# Altium schematic sheet UpperBoardAnalogInputs.SchDoc
size A4; PageSetup: Record=PageOptions|CenterHorizontal=True|CenterVertical=True|PrintScale=1.00|XCorrection=1.00|YCorrection=1.00|PrintKind=0|BorderSize=5000000|LeftOffset=0|BottomOffset=0|Orientation=2|PaperLength=1000|PaperWidth=1000|Scale=100|PaperSource=7|PrintQuality=-3|MediaType=1|DitherType=10|PrintScaleMode=1|PaperKind=A4|PaperIndex=9
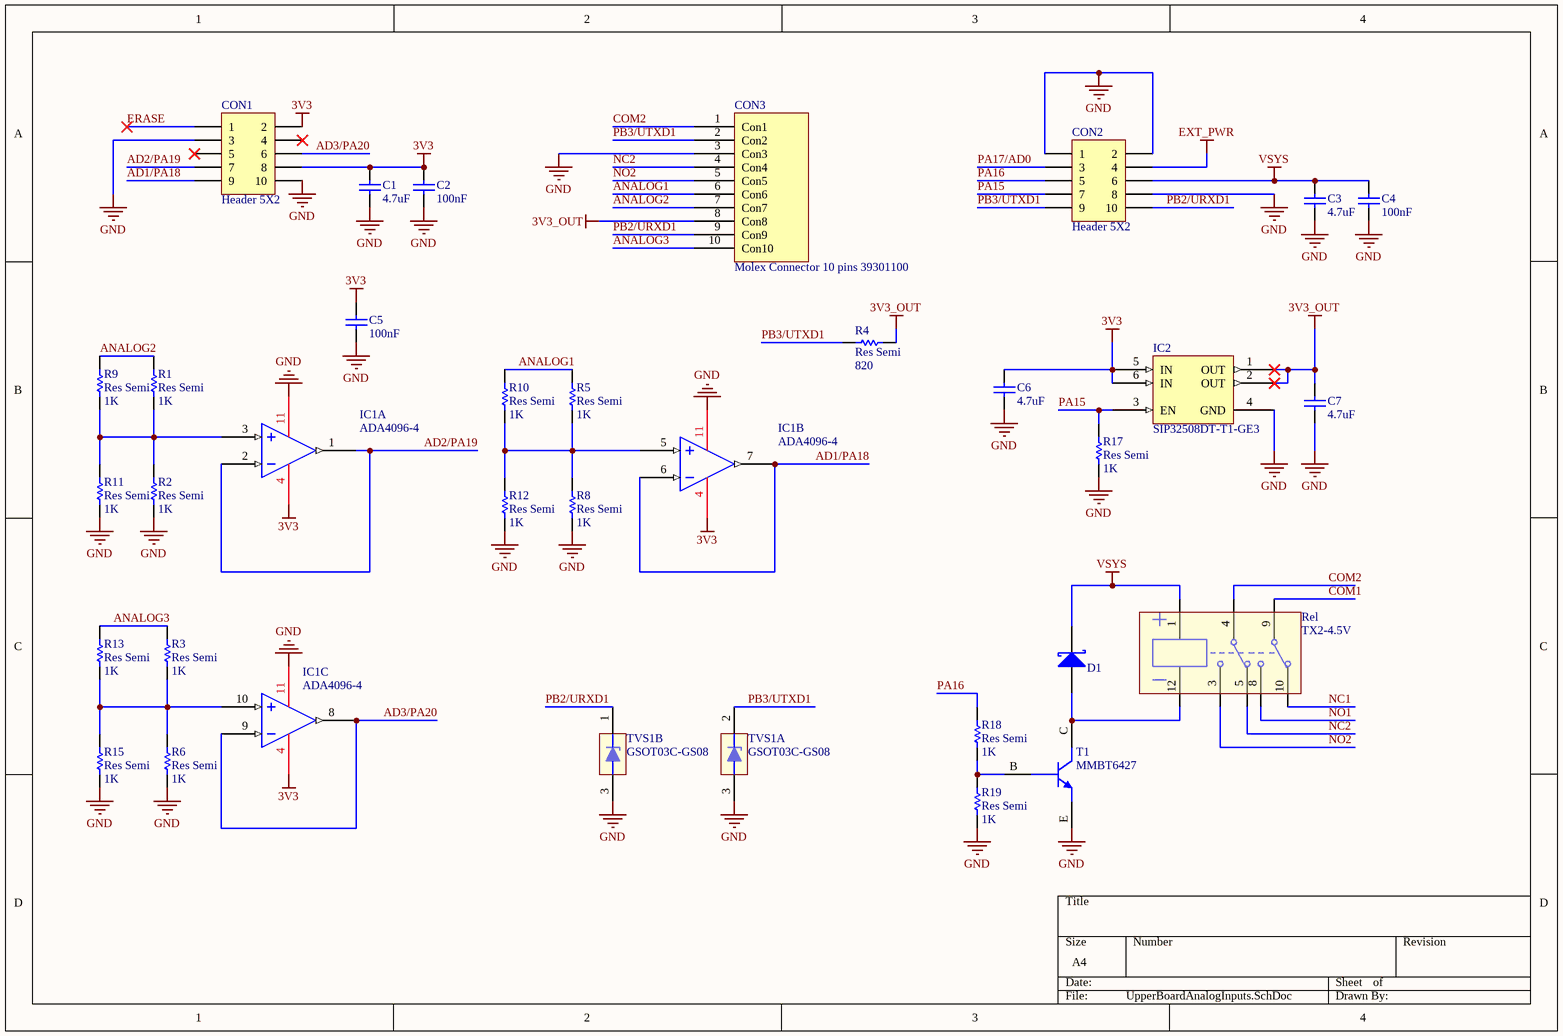
[diagram p0: UpperBoardAnalogInputs.SchDoc]

## Parts
C1  value 4.7uF  [2012[0805]]  (hidden comment: Cap1)
C2  value 100nF  [2012[0805]]  (hidden comment: Cap1)
C3  value 4.7uF  [2012[0805]]  (hidden comment: Cap1)
C4  value 100nF  [2012[0805]]  (hidden comment: Cap1)
C5  value 100nF  [2012[0805]]  (hidden comment: Cap1)
C6  value 4.7uF  [2012[0805]]  (hidden comment: Cap1)
C7  value 4.7uF  [2012[0805]]  (hidden comment: Cap1)
CON1  Header 5X2  [Header 2x5,1.27mm]
CON2  Header 5X2  [Header 2x5,1.27mm]
CON3  Molex Connector 10 pins 39301100  [molex 003930-1100]
D1  PMEG2005ET  [PMEG2005ET]  (value not drawn)
IC1  ADA4096-4  [ADA4096-4]  (parts A,B,C of 4)
IC2  SIP32508DT-T1-GE3  [SOT23-6]
R1  Res Semi  value 1K  [2012[0805]]
R2  Res Semi  value 1K  [2012[0805]]
R3  Res Semi  value 1K  [2012[0805]]
R4  Res Semi  value 820  [2012[0805]]
R5  Res Semi  value 1K  [2012[0805]]
R6  Res Semi  value 1K  [2012[0805]]
R8  Res Semi  value 1K  [2012[0805]]
R9  Res Semi  value 1K  [2012[0805]]
R10  Res Semi  value 1K  [2012[0805]]
R11  Res Semi  value 1K  [2012[0805]]
R12  Res Semi  value 1K  [2012[0805]]
R13  Res Semi  value 1K  [2012[0805]]
R15  Res Semi  value 1K  [2012[0805]]
R17  Res Semi  value 1K  [2012[0805]]
R18  Res Semi  value 1K  [2012[0805]]
R19  Res Semi  value 1K  [2012[0805]]
Rel  TX2-4.5V  [Tx4.5 Relay]
T1  MMBT6427  [MMBT6427]
TVS1  GSOT03C-GS08  [SOT95P245X110-3N]  (parts A,B of 2)

## Nets
3V3: C1.2 C2.2 C5.2 C6.2 CON1.2 CON1.8 IC1.4(V+) IC2.5(IN) IC2.6(IN)
3V3_OUT: C7.2 CON3.8(Con8) IC2.1(OUT) IC2.2(OUT) R4.1
EXT_PWR: CON2.4
GND: C1.1 C2.1 C3.1 C4.1 C5.1 C6.1 C7.1 CON1.3 CON1.10 CON2.1 CON2.2 CON2.8 CON3.3(Con3) IC1.11(V-) IC2.4(GND) R2.1 R6.1 R8.1 R11.1 R12.1 R15.1 R17.1 R19.1 T1.E TVS1.3
VSYS: C3.2 C4.2 CON2.6 D1.3(K) Rel.1
AD1/PA18: CON1.9 IC1.6(-INB) IC1.7(OUTB)
AD2/PA19: CON1.7 IC1.1(OUTA) IC1.2(-INA)
AD3/PA20: CON1.6 IC1.8(OUTC) IC1.9(-INC)
ANALOG1: CON3.6(Con6) R5.2 R10.2
ANALOG2: CON3.7(Con7) R1.2 R9.2
ANALOG3: CON3.10(Con10) R3.2 R13.2
COM1: Rel.9
COM2: CON3.1(Con1) Rel.4
ERASE: CON1.1
NC1: Rel.10
NC2: CON3.4(Con4) Rel.5
NO1: Rel.8
NO2: CON3.5(Con5) Rel.3
PA15: CON2.7 IC2.3(EN) R17.2
PA16: CON2.5 R18.2
PA17/AD0: CON2.3
PB2/URXD1: CON2.10 CON3.9(Con9) TVS1.1
PB3/UTXD1: CON2.9 CON3.2(Con2) R4.2 TVS1.2
NetD1_1: D1.1(A) Rel.12 T1.C
NetIC1_3: IC1.3(+INA) R1.1 R2.2 R9.1 R11.2
NetIC1_5: IC1.5(+INB) R5.1 R8.2 R10.1 R12.2
NetIC1_10: IC1.10(+INC) R3.1 R6.2 R13.1 R15.2
NetR18_1: R18.1 R19.2 T1.B

Not connected (* = marked no-connect by the designer): CON1 4* 5*

## Library data of the parts
C1-C7 = Cap1: Voltage: 6.3V; Manufacturer: *; Manufacturer Part No: *; Component Type: Capacitor; Order Code: *; Supplier: *
CON1 CON2 = Header 5X2: Header, 5-Pin, Dual row,1.27mm; LatestRevisionDate: 17-Jul-2002; LatestRevisionNote: Re-released for DXP Platform.; Publisher: Altium Limited
D1 = PMEG2005ET: Manufacturer: NEXPERIA; Manufacturer Part No: PMEG2005ET; Component Type: Diode Schottky
IC1 = ADA4096-4: 30 V, Micropower, Overvoltage Protection,  Rail-to-Rail Input/Output Amplifiers; Manufacturer: Analog Devices; Manufacturer Part Number: ADA4096-4
IC2 = SIP32508DT-T1-GE3: VISHAY  SIP32508DT-T1-GE3  Power Load Switch, Slew Rate Controlled, High Side, Active High, 1 Output, 5.5V, TSOT-23-6; Manufacturer: VISHAY; Manufacturer Part No: SIP32508DT-T1-GE3; Component Type: IC
R1-R6 R8-R13 R15 R17-R19 = Res Semi: Semiconductor Resistor; Published: 8-Jun-2000; LatestRevisionDate: 17-Jul-2002; LatestRevisionNote: Re-released for DXP Platform.; PackageReference: AXIAL-0.5; Publisher: Altium Limited
T1 = MMBT6427: Manufacturer: ON SEMICONDUCTOR/FAIRCHILD; Component Type: Darlinghton; Manufacturer Part No: MMBT6427; Supplier: *; Order Code: *
TVS1 = GSOT03C-GS08: Two-Line ESD-Protection in SOT-23; Manufacturer: Vishay; Manufacturer Part Number: GSOT03C-GS08; Distributor: Autotech
CON3 = Molex Connector 10 pins 39301100: Manufacturer: MOLEX; Manufacturer Part No: 39301100; Component Type: Connector; Order Code: *; Supplier: *